# Altium schematic sheet thermistor-input-10k.SchDoc: Thermistor Input
size A4; DrawnBy: B. Almeida, D. Vogel; Organization: UTAT SS; Revision: 1.2
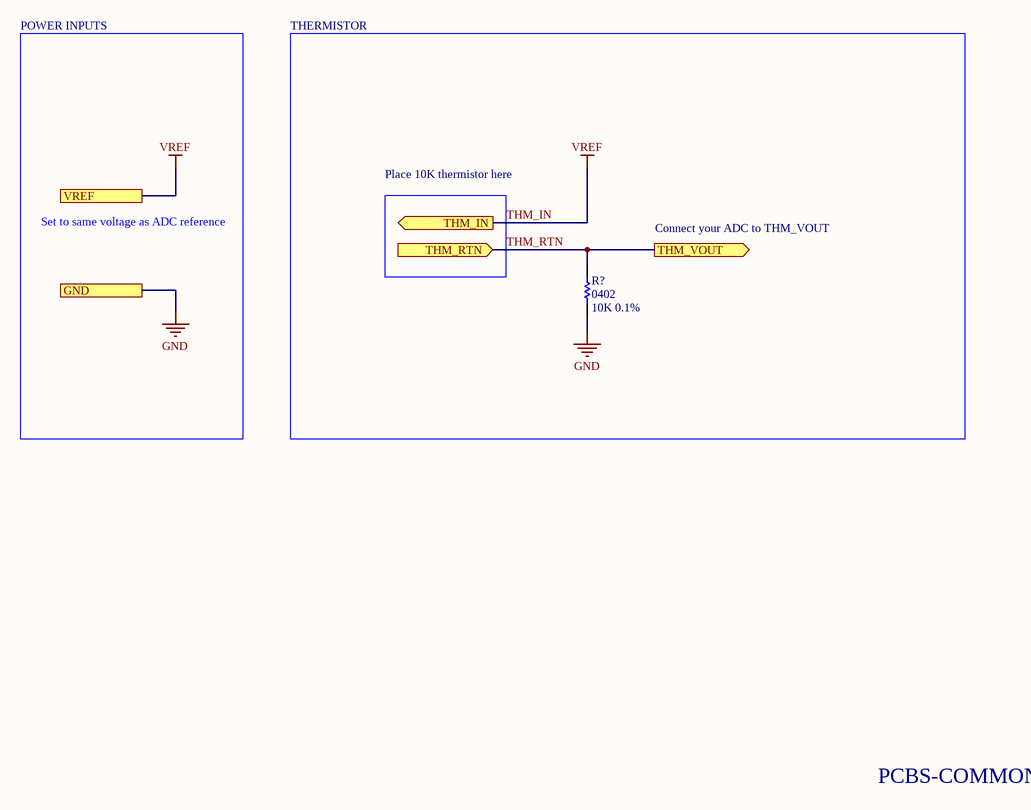
[diagram p0: thermistor-input-10k.SchDoc]

## Parts
R?  0402  value 10K 0.1%  [RES0402R]

## Ports
GND, THM_IN (out), THM_RTN (in), THM_VOUT (out), VREF

## Nets
GND: R?.1 ; port GND
THM_IN: port VREF, port THM_IN  [also labelled VREF]
THM_RTN: R?.2 ; port THM_VOUT, port THM_RTN

## Notes on the sheet
- POWER INPUTS
- THERMISTOR
- Place 10K thermistor here
- Set to same voltage as ADC reference
- Connect your ADC to THM_VOUT
- PCBS-COMMON

## Library data of the parts
R? = RES0402: 0402 resistor; Manufacturer: Panasonic; Manufacturer Part Number: ERA-2AEB103X; Power Rating: 63mW; Resistance: 10kR; Tolerance: 0.1%; Voltage Rating: 25V; Temperature Coefficient: 25ppm/°C; Supplier 1: Digi-Key; Supplier Part Number 1: P10KDCCT-ND; Stock 1: 1578480; Pricing 1: 1=0.45, 10=0.321, 100=0.1283, 1000=0.06322, 2500=0.05858, 5000=0.053 (USD); Mount: Surface Mount; Case/Package: 0402; Number of Pins: 2; Case Code (Imperial): 0402; Case Code (Metric): 1005; Contact Plating: Tin; Min Operating Temperature: -55°C; Max Operating Temperature: 155°C; Packaging: Tape and Reel; Package Quantity: 1; Composition: Metal Film,Thin Film; Number of Terminations: 2; Termination: SMD/SMT; Military Standard: Not; Max Power Dissipation: 63mW; Voltage Rating (DC): 25V; Features: Automotive AEC-Q200; Length: 1mm; Height: 0.35mm; Width: 0.5mm; Depth: 0.5mm; Radiation Hardening: No; REACH SVHC: No SVHC; Lead Free: Lead Free; ComponentLink1URL: http://uk.rs-online.com/webdocs/0bee/0900766b80beefcc.pdf?src-supplier=RSComponents; ComponentLink1Description: http://uk.rs-online.com/webdocs/0bee/0900766b80beefcc.pdf?src-supplier=RSComponents; ComponentLink2URL: http://industrial.panasonic.com/www-data/pdf/AOA0000/AOA0000CE26.pdf?src-supplier=Avnet; ComponentLink2Description: http://industrial.panasonic.com/www-data/pdf/AOA0000/AOA0000CE26.pdf?src-supplier=Avnet; ComponentLink3URL: http://www.farnell.com/datasheets/328837.pdf?src-supplier=Element14; ComponentLink3Description: http://www.farnell.com/datasheets/328837.pdf?src-supplier=Element14; ComponentLink4URL: http://www.farnell.com/datasheets/2052875.pdf?src-supplier=Farnell; ComponentLink4Description: http://www.farnell.com/datasheets/2052875.pdf?src-supplier=Farnell; ComponentLink5URL: http://industrial.panasonic.com/www-data/pdf/AOA0000/AOA0000CE26.pdf?src-supplier=Future+Electronics; ComponentLink5Description: http://industrial.panasonic.com/www-data/pdf/AOA0000/AOA0000CE26.pdf?src-supplier=Future+Electronics; ComponentLink6URL: http://www.alliedelec.com/m/d/b6b0537e86f421aa7f5975bb1d8f429a.pdf?src-supplier=Allied+Electronics; ComponentLink6Description: http://www.alliedelec.com/m/d/b6b0537e86f421aa7f5975bb1d8f429a.pdf?src-supplier=Allied+Electronics